# EAGLE schematic lightboard (EAGLE 9.6.2)
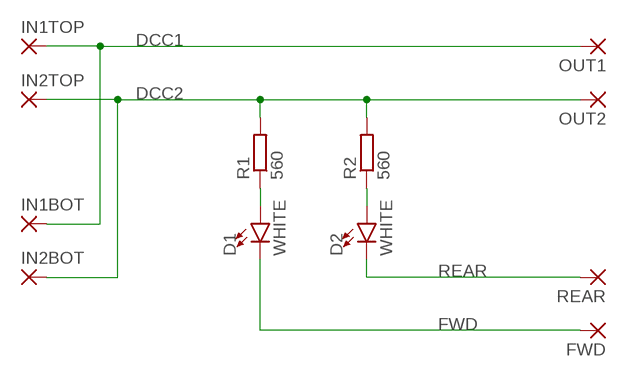
[diagram p0: schematic, sheet 1]

## Parts
D1  WHITE  LED-WHITE1206  [LED-1206]
D2  WHITE  LED-WHITE1206  [LED-1206]
FWD  SMD2  [SMD1,27-2,54]
IN1BOT  SMD2  [SMD1,27-2,54]
IN1TOP  SMD2  [SMD1,27-2,54]
IN2BOT  SMD2  [SMD1,27-2,54]
IN2TOP  SMD2  [SMD1,27-2,54]
OUT1  SMD2  [SMD1,27-2,54]
OUT2  SMD2  [SMD1,27-2,54]
R1  560  R-EU_R0603  [R0603]
R2  560  R-EU_R0603  [R0603]
REAR  SMD2  [SMD1,27-2,54]

## Nets
DCC1: IN1BOT.1(P) IN1TOP.1(P) OUT1.1(P)
DCC2: IN2BOT.1(P) IN2TOP.1(P) OUT2.1(P) R1.2 R2.2
FWD: D1.C FWD.1(P)
N$1: D1.A R1.1
N$2: D2.A R2.1
REAR: D2.C REAR.1(P)

## Library data of the parts
D1 D2 = SparkFun-LED:LED-WHITE: White SMD LED Used in manufacturing several products at SparkFun. Packages: 0603 - Bright White SMD 0603 package[Product Link] <http://www.kingbrightusa.com/product.asp?catalog_name=LED&product_id=APT1608QWF/D> 1206 - Bright White SMD1206 package [Product Link] <http://www.kingbrightusa.com/product.asp?catalog_name=LED&product_id=APT3216QWF/D> 3014 - Super Bright SMD 3014 package [Datasheet] <http://www.lumileds.com/uploads/459/DS208-pdf> SparkFun Products: Blackberry Trackballer Breakout <https://www.sparkfun.com/products/13169> Digital SandBox <https://www.sparkfun.com/products/12651>; PROD_ID: DIO-09955
FWD IN1BOT IN1TOP IN2BOT IN2TOP OUT1 OUT2 REAR = wirepad:SMD2: SMD PAD
R1 R2 = resistor:R-EU_: RESISTOR, European symbol